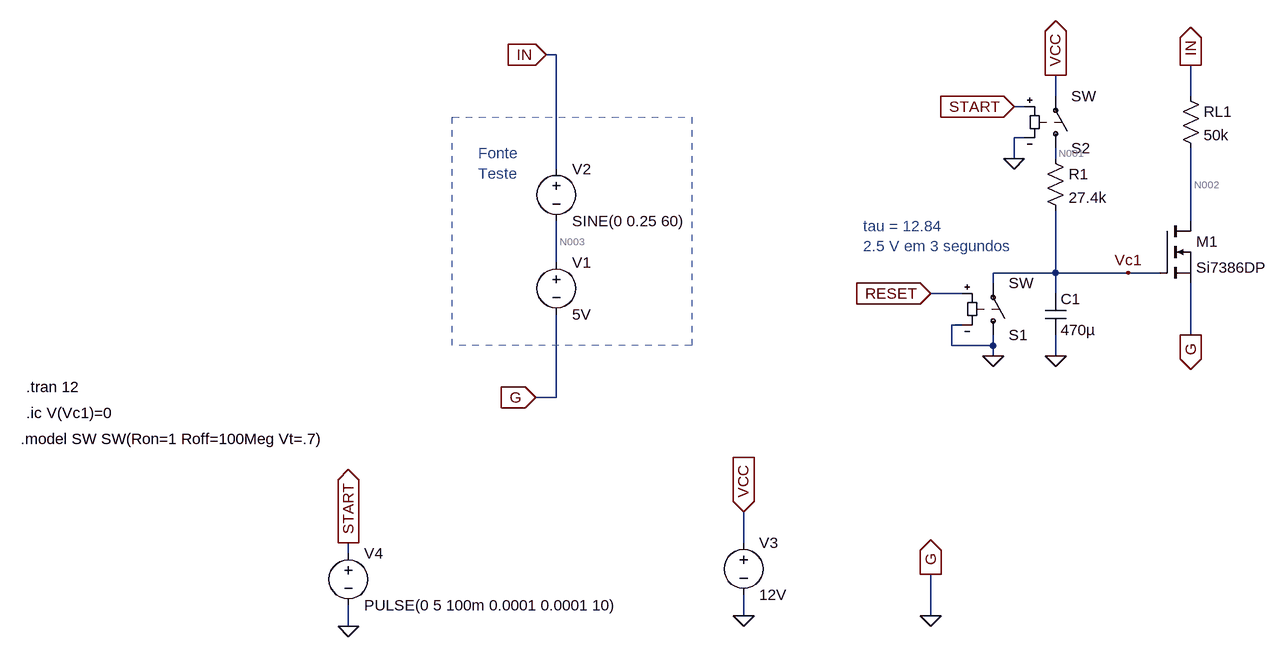
[diagram p0: schematic carga.asc]
carga.asc, the LTspice schematic file:
Version 4
SHEET 1 1164 820
WIRE 64 -80 48 -80
WIRE 832 -16 832 -48
WIRE 1040 -16 1040 -64
WIRE 784 0 768 0
WIRE 784 48 768 48
WIRE 768 80 768 48
WIRE 832 80 832 64
WIRE 64 96 64 -80
WIRE 1040 176 1040 64
WIRE 64 240 64 176
WIRE 832 256 832 160
WIRE 832 256 736 256
WIRE 944 256 832 256
WIRE 992 256 944 256
WIRE 736 272 736 256
WIRE 688 288 640 288
WIRE 832 288 832 256
WIRE 688 336 672 336
WIRE 1040 352 1040 272
WIRE 672 368 672 336
WIRE 736 368 736 352
WIRE 736 368 672 368
WIRE 736 384 736 368
WIRE 832 384 832 352
WIRE 64 448 64 320
WIRE 64 448 32 448
WIRE 352 672 352 624
WIRE -256 688 -256 672
WIRE 352 784 352 752
WIRE 640 784 640 720
WIRE -256 800 -256 768
FLAG 48 -80 IN
IOPIN 48 -80 In
FLAG 32 448 G
IOPIN 32 448 In
FLAG 352 784 0
FLAG 640 720 G
IOPIN 640 720 Out
FLAG 640 784 0
FLAG 352 624 VCC
IOPIN 352 624 In
FLAG 832 -48 VCC
IOPIN 832 -48 Out
FLAG 1040 -64 IN
IOPIN 1040 -64 Out
FLAG 1040 352 G
IOPIN 1040 352 Out
FLAG 832 384 0
FLAG 640 288 RESET
IOPIN 640 288 In
FLAG 736 384 0
FLAG 944 256 Vc1
FLAG 768 0 START
IOPIN 768 0 In
FLAG 768 80 0
FLAG -256 800 0
FLAG -256 672 START
IOPIN -256 672 Out
SYMBOL voltage 64 224 R0
SYMATTR InstName V1
SYMATTR Value 5V
SYMBOL voltage 64 80 R0
WINDOW 123 0 0 Left 0
WINDOW 39 0 0 Left 0
SYMATTR InstName V2
SYMATTR Value SINE(0 0.25 60)
SYMBOL voltage 352 656 R0
WINDOW 123 0 0 Left 0
WINDOW 39 0 0 Left 0
SYMATTR InstName V3
SYMATTR Value 12V
SYMBOL res 816 64 R0
SYMATTR InstName R1
SYMATTR Value 27.4k
SYMBOL cap 816 288 R0
SYMATTR InstName C1
SYMATTR Value 470µ
SYMBOL nmos 992 176 R0
SYMATTR InstName M1
SYMATTR Value Si7386DP
SYMBOL res 1024 -32 R0
SYMATTR InstName RL1
SYMATTR Value 50k
SYMBOL sw 736 368 M180
SYMATTR InstName S1
SYMBOL sw 832 80 M180
SYMATTR InstName S2
SYMBOL voltage -256 672 R0
WINDOW 123 0 0 Left 0
WINDOW 39 0 0 Left 0
SYMATTR InstName V4
SYMATTR Value PULSE(0 5 100m 0.0001 0.0001 10)
TEXT -56 72 Left 2 ;Fonte\nTeste
TEXT 536 184 Left 2 ;tau = 12.84\n2.5 V em 3 segundos
TEXT -752 432 Left 2 !.tran 12
TEXT -760 512 Left 2 !.model SW SW(Ron=1 Roff=100Meg Vt=.7)
TEXT -752 472 Left 2 !.ic V(Vc1)=0
RECTANGLE Normal 272 368 -96 16 2

The netlist it stands for:
* carga.asc
V1 N003 0 5V
V2 IN N003 SINE(0 0.25 60)
V3 VCC 0 12V
R1 N001 Vc1 27.4k
C1 Vc1 0 470µ
M1 N002 Vc1 0 0 Si7386DP
RL1 IN N002 50k
S1 0 Vc1 RESET 0 SW
S2 N001 VCC START 0 SW
V4 START 0 PULSE(0 5 100m 0.0001 0.0001 10)
.model NMOS NMOS
.model PMOS PMOS
.lib standard.mos
* Fonte
* Teste
* tau = 12.84
* 2.5 V em 3 segundos
.tran 12
.model SW SW(Ron=1 Roff=100Meg Vt=.7)
.ic V(Vc1)=0
.backanno
.end

* Results of the author's LTspice run, read from the files saved beside the schematic
* Operating Point, zero values left out:
*   V(n003) = 5 V
*   V(in) = 5 V
*   V(vcc) = 12 V
*   V(n001) = 3.287 mV
*   V(n002) = 5 V
*   Id(M1) = 7.401 pA
*   Is(M1) = -7.401 pA
*   I(Rl1) = 12.46 pA
*   I(R1) = 120 nA
*   I(S2) = 120 nA
*   I(V3) = -120 nA
*   I(V2) = -12.46 pA
*   I(V1) = -12.46 pA
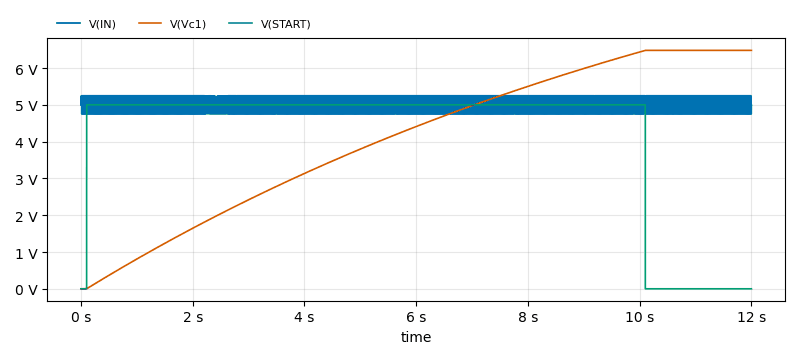
[diagram p1: Transient Analysis of carga.asc, plotted from the saved traces]
* Transient Analysis, 1 run:
*   V(IN): min 4.75 V, max 5.25 V, average 5 V, rms 5.004 V, last 5 V
*   V(Vc1): min 0 V, max 6.479 V, average 4.072 V, rms 4.546 V, last 6.479 V
*   V(START): min 0 V, max 5 V, average 4.167 V, rms 4.564 V, last 0 V